# Altium schematic sheet EFR32BG24B110F1536IM48-B.SchDoc
size A; SheetNumber: 4; SheetTotal: 4
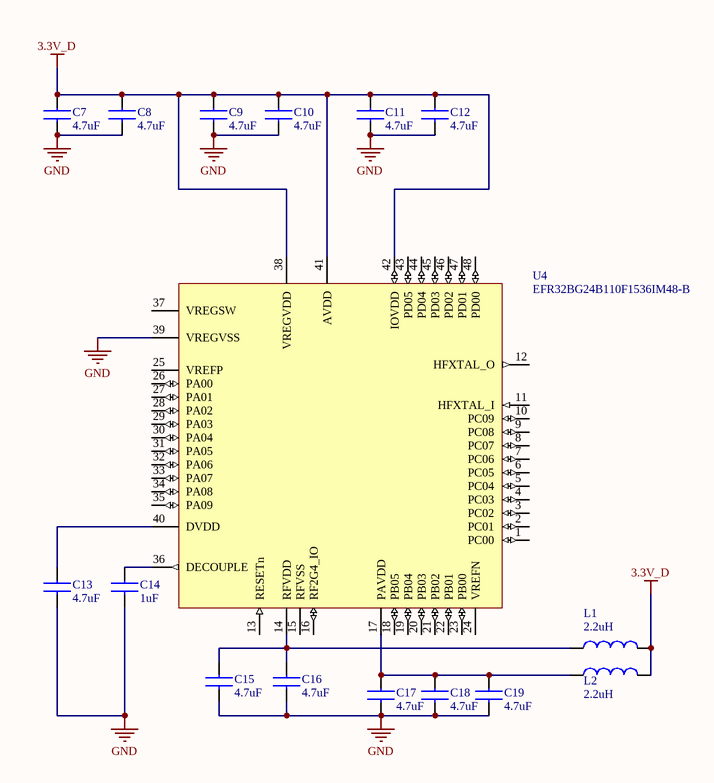
[diagram p0: EFR32BG24B110F1536IM48-B.SchDoc]

## Parts
C7  4.7uF  [C_0603]
C8  4.7uF  [C_0603]
C9  4.7uF  [C_0603]
C10  4.7uF  [C_0603]
C11  4.7uF  [C_0603]
C12  4.7uF  [C_0603]
C13  4.7uF  [C_0603]
C14  1uF  [C_0603]
C15  4.7uF  [C_0603]
C16  4.7uF  [C_0603]
C17  4.7uF  [C_0603]
C18  4.7uF  [C_0603]
C19  4.7uF  [C_0603]
L1  2.2uH  [L_0603]
L2  2.2uH  [L_0603]
U4  EFR32BG24B110F1536IM48-B  [48-QFN_6x6_2]

## Nets
3.3V_D: C7.1 C8.1 C9.1 C10.1 C11.1 C12.1 L1.2 L2.2 U4.38(VREGVDD) U4.41(AVDD) U4.42(IOVDD)
GND: C7.2 C8.2 C9.2 C10.2 C11.2 C12.2 C13.1 C14.1 C15.2 C16.2 C17.2 C18.2 C19.2 U4.39(VREGVSS)
NetC13_2: C13.2 U4.40(DVDD)
NetC14_2: C14.2 U4.36(DECOUPLE)
NetC15_1: C15.1 C16.1 L1.1 U4.14(RFVDD)
NetC17_1: C17.1 C18.1 C19.1 L2.1 U4.17(PAVDD)

Not connected (* = marked no-connect by the designer): U4 1(PC00) 2(PC01) 3(PC02) 4(PC03) 5(PC04) 6(PC05) 7(PC06) 8(PC07) 9(PC08) 10(PC09) 11(HFXTAL_I) 12(HFXTAL_O) 13(RESETn) 15(RFVSS) 16(RF2G4_IO) 18(PB05) 19(PB04) 20(PB03) 21(PB02) 22(PB01) 23(PB00) 24(VREFN) 25(VREFP) 26(PA00) 27(PA01) 28(PA02) 29(PA03) 30(PA04) 31(PA05) 32(PA06) 33(PA07) 34(PA08) 35(PA09) 37(VREGSW) 43(PD05) 44(PD04) 45(PD03) 46(PD02) 47(PD01) 48(PD00)

## Library data of the parts
C7-C13 C15-C19 = C_4.7U_0603: CAP CER 4.7UF 10V X5R 0603; Manufacturer: Murata; Manufacturer Part Number: GRM188R61A475KAAJD; Dielectric Material: Ceramic; Multilayer: Yes; Tolerance  (fill in as +-): 10%; Supplier: Digikey; Supplier Part Number: 490-14373-1-ND; RoHS: Yes; Category: Ceramic Capacitors; Stock: 53982; Pricing: 1=0.38, 10=0.251, 50=0.185, 100=0.1506, 500=0.11888, 1000=0.10039 (USD); Mounting Technology: Surface Mount; Pins: 2; Package Shape: Rectangular; Case/Package: 0603; Terminal Finish: Nickel; Min Operating Temperature: -55°C; Max Operating Temperature: 85°C; JESD-609 Code: e3; Value: 4.7uF; Capacitor Type: Ceramic; Packaging: Tape and Reel; Tolerance (fill in as +-): 10%; Rated DC Voltage (URdc): 10V; Temperature Characteristics Code: X5R; Termination: Wraparound; Reach SVHC Compliant: Yes; RoHS Compliant: Yes; ComponentLink1URL: https://datasheet.ciiva.com:443/pdfs/VipMasterIC/IC/MURE/MURE-S-A0004349797/MURE-S-A0004352595-1.pdf?src-supplier=IHS+Markit; ComponentLink1Description: https://datasheet.ciiva.com:443/pdfs/VipMasterIC/IC/MURE/MURE-S-A0004349797/MURE-S-A0004352595-1.pdf?src-supplier=IHS+Markit; ComponentLink2URL: http://search.murata.co.jp/Ceramy/image/img/A01X/G101/ENG/GRM188R61A475KAAJ-01.pdf?src-supplier=Digikey; ComponentLink2Description: http://search.murata.co.jp/Ceramy/image/img/A01X/G101/ENG/GRM188R61A475KAAJ-01.pdf?src-supplier=Digikey
C14 = C_1U_0603: CAP CER 1UF 10V X5R 0603; Manufacturer: Murata; Manufacturer Part Number: GRM188R61A105KA61D; Dielectric Material: Ceramic; Multilayer: Yes; Tolerance  (fill in as +-): 10%; Supplier: Digikey; Supplier Part Number: 490-1543-1-ND; RoHS: Yes; Category: Ceramic Capacitors; Stock: 1314759; Pricing: 1=0.12, 10=0.08, 50=0.048, 100=0.0378, 500=0.02794, 1000=0.02313 (USD); Mounting Technology: Surface Mount; Pins: 2; Package Shape: Rectangular; Case/Package: 0603; Terminal Finish: Nickel; Min Operating Temperature: -55°C; Max Operating Temperature: 85°C; JESD-609 Code: e3; Value: 1uF; Capacitor Type: Ceramic; Package Style: SMTMeter; Packaging: Tape and Reel; Tolerance (fill in as +-): 10%; Rated DC Voltage (URdc): 10V; Temperature Characteristics Code: X5R; Termination: Wraparound; Length: 1.6mm; Width: 0.8mm; Height: 0.8mm; Reach SVHC Compliant: Yes; RoHS Compliant: Yes; ComponentLink1URL: https://psearch.en.murata.com:443/capacitor/product/GRM188R61A105KA61%23.pdf?src-supplier=IHS+Markit; ComponentLink1Description: https://psearch.en.murata.com:443/capacitor/product/GRM188R61A105KA61%23.pdf?src-supplier=IHS+Markit; ComponentLink2URL: https://datasheet.ciiva.com/19476/1857381-19476568.pdf?src-supplier=Jameco; ComponentLink2Description: https://datasheet.ciiva.com/19476/1857381-19476568.pdf?src-supplier=Jameco; ComponentLink3URL: https://datasheet.ciiva.com/18102/getdatasheetpartid-85467-18102910.pdf?src-supplier=Verical; ComponentLink3Description: https://datasheet.ciiva.com/18102/getdatasheetpartid-85467-18102910.pdf?src-supplier=Verical; ComponentLink4URL: https://datasheet.ciiva.com/7719/608985-7719036.pdf?src-supplier=Element14; ComponentLink4Description: https://datasheet.ciiva.com/7719/608985-7719036.pdf?src-supplier=Element14; ComponentLink5URL: https://datasheet.ciiva.com/22706/608985-22706782.pdf?src-supplier=Element14; ComponentLink5Description: https://datasheet.ciiva.com/22706/608985-22706782.pdf?src-supplier=Element14; ComponentLink6URL: https://datasheet.ciiva.com/131/partnumbering-e-01-131742.pdf?src-supplier=Digikey; ComponentLink6Description: https://datasheet.ciiva.com/131/partnumbering-e-01-131742.pdf?src-supplier=Digikey; ComponentLink7URL: https://datasheet.ciiva.com/131/partnumbering-e-01-131741.pdf?src-supplier=Digikey; ComponentLink7Description: https://datasheet.ciiva.com/131/partnumbering-e-01-131741.pdf?src-supplier=Digikey; ComponentLink8URL: https://datasheet.ciiva.com/131/partnumbering-e-01-131743.pdf?src-supplier=Digikey; ComponentLink8Description: https://datasheet.ciiva.com/131/partnumbering-e-01-131743.pdf?src-supplier=Digikey; ComponentLink9URL: https://datasheet.ciiva.com/16199/product-16199724.pdf?src-supplier=Future+Electronics; ComponentLink9Description: https://datasheet.ciiva.com/16199/product-16199724.pdf?src-supplier=Future+Electronics
L1 L2 = L_2.2U: General Purpose Inductor, 2.2uH, 20%, 1 Element, Ferrite-Core, SMD, 0603; Manufacturer: Murata; Manufacturer Part Number: LQM18PN2R2MGHD; DC Resistance (DCR): 250mR; Inductor Application: RF INDUCTOR; Channels: 1; Max Current Rating: 1.05A; Self Resonant Frequency: 70MHz; Shape/Size Description: RECTANGULAR PACKAGE; Shielding: Shielded; Test Frequency: 1MHz; Supplier: Digikey; Supplier Part Number: 490-14478-1-ND; RoHS: Yes; Category: Fixed Inductors; Stock: 148488; Pricing: 1=0.26, 10=0.208, 25=0.1916, 50=0.1756, 100=0.1549, 250=0.15008, 500=0.1341, 1000=0.10856 (USD); Pins: 2; Core Material: Ferrite; Min Operating Temperature: -40°C; Max Operating Temperature: 85°C; Tolerance: 20%; Inductance-Nom (L): 2.2uH; Inductor Type: GENERAL PURPOSE INDUCTOR; Surface Mount: Yes; Terminal Placement: Dual Ended; Termination: Wraparound; Reach SVHC Compliant: Yes; RoHS Compliant: Yes; ComponentLink1URL: https://psearch.en.murata.com:443/inductor/product/LQM18PN2R2MGH_.pdf?src-supplier=IHS+Markit; ComponentLink1Description: https://psearch.en.murata.com:443/inductor/product/LQM18PN2R2MGH_.pdf?src-supplier=IHS+Markit; ComponentLink2URL: https://media.digikey.com/pdf/Data%20Sheets/Murata%20PDFs/LQx_Land-Patterns.pdf?src-supplier=Digikey; ComponentLink2Description: https://media.digikey.com/pdf/Data%20Sheets/Murata%20PDFs/LQx_Land-Patterns.pdf?src-supplier=Digikey
U4 = U_EFR32BG24B110F1536IM48-B: BG24, 2.4 GHz, 1536kB Flash, 256kB RAM, +10 dBm, Secure Vault High, 20-bit ADC +125C, QFN48; Manufacturer: Silicon Labs; Supplier: Digikey; Supplier Part Number: 336-EFR32BG24B110F1536IM48-B-ND; Manufacturer Part Number: EFR32BG24B110F1536IM48-B; RoHS: No; Category: RF Receivers, Transceivers; Stock: 2713; Pricing: 1=7.9, 10=7.244, 25=6.5852, 80=5.92663, 230=5.43278, 490=4.9389, 980=4.44501 (USD)